# Altium schematic sheet Connectors.SchDoc
size A; SheetNumber: 5; SheetTotal: 8
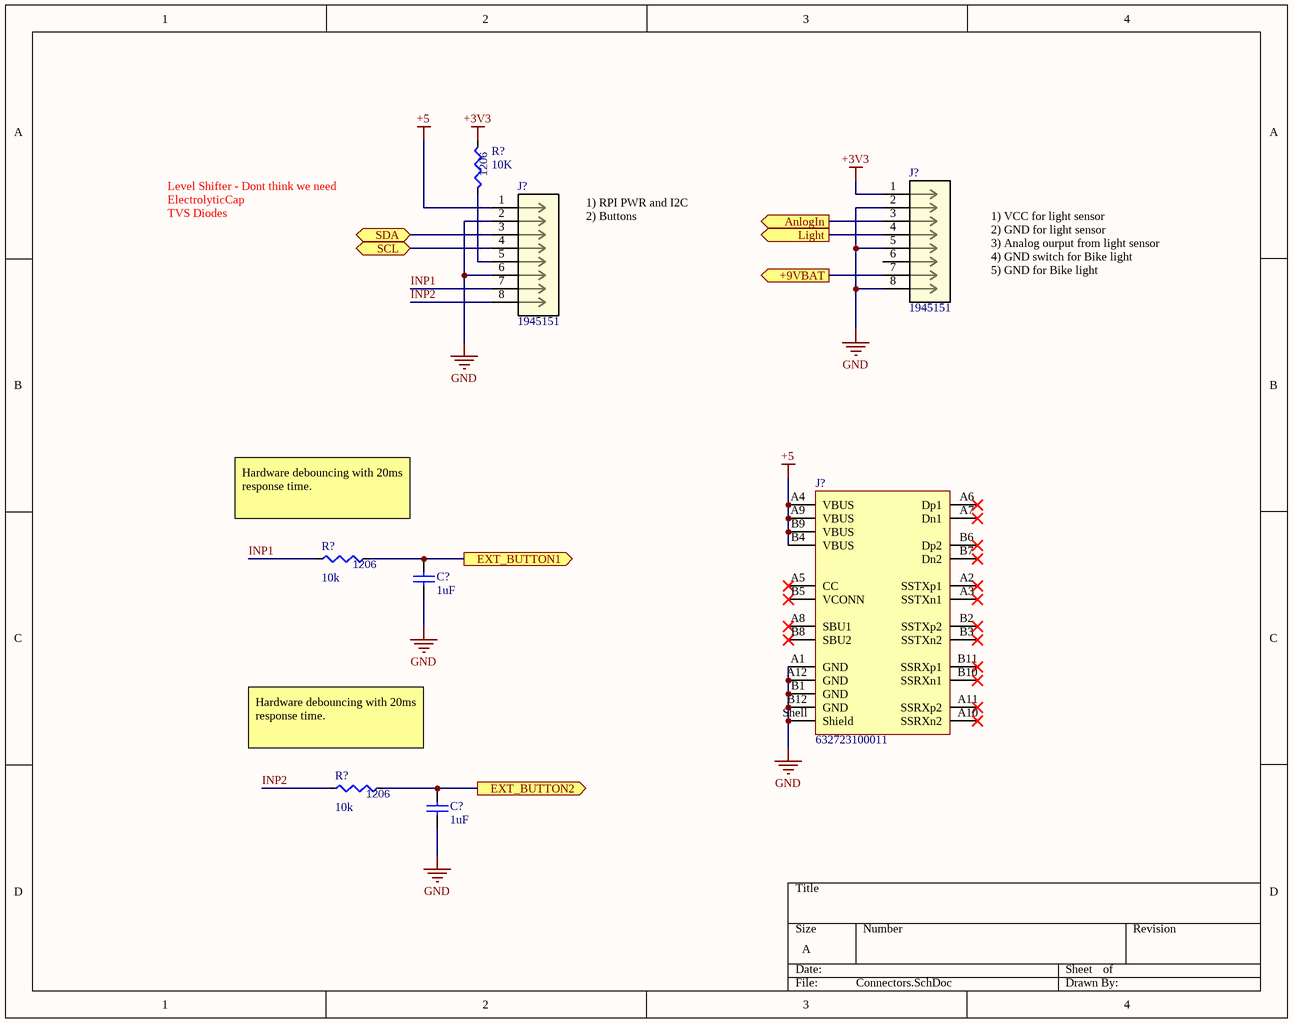
[diagram p0: Connectors.SchDoc]

## Parts
(Parts that share a designator on the sheet are numbered #1, #2 ... from top to bottom, then left to right.)
C?#1  1uF  [C1206]
C?#2  1uF  [C1206]
J?#1  1945151  [1945151-Footprint-1]
J?#2  1945151  [1945151-Footprint-1]
J?#3  632723100011  [632723100011]
R?#1  10K  [R1206]
R?#2  10k  [R1206]
R?#3  10k  [R1206]

## Ports
+9VBAT (out), AnlogIn (out), EXT_BUTTON1 (out), EXT_BUTTON2 (out), Light (out), SCL (bidir), SDA (bidir)

## Nets
+3V3: J?#1.1 R?#1.2
+5: J?#2.1 J?#3.A4(VBUS) J?#3.A9(VBUS) J?#3.B4(VBUS) J?#3.B9(VBUS)
GND: C?#1.1 C?#2.1 J?#1.2 J?#1.5 J?#1.8 J?#2.2 J?#2.6 J?#3.A1(GND) J?#3.A12(GND) J?#3.B1(GND) J?#3.B12(GND) J?#3.Shell(Shield)
+9VBAT: J?#1.7 ; port +9VBAT
AnlogIn: J?#1.3 ; port AnlogIn
EXT_BUTTON1: C?#1.2 R?#2.1 ; port EXT_BUTTON1
EXT_BUTTON2: C?#2.2 R?#3.1 ; port EXT_BUTTON2
INP1: J?#2.7 R?#2.2
INP2: J?#2.8 R?#3.2
Light: J?#1.4 ; port Light
SCL: J?#2.4 ; port SCL
SDA: J?#2.3 ; port SDA
NetJ?#2_5: J?#2.5 R?#1.1

Not connected (* = marked no-connect by the designer): J?#1 6; J?#3 A2(SSTXp1)* A3(SSTXn1)* A5(CC)* A6(Dp1)* A7(Dn1)* A8(SBU1)* A10(SSRXn2)* A11(SSRXp2)* B2(SSTXp2)* B3(SSTXn2)* B5(VCONN)* B6(Dp2)* B7(Dn2)* B8(SBU2)* B10(SSRXn1)* B11(SSRXp1)*

## Notes on the sheet
- Level Shifter - Dont think we need
- ElectrolyticCap
- TVS Diodes
- 1) RPI PWR and I2C
- 2) Buttons
- 1) VCC for light sensor
- 2) GND for light sensor
- 3) Analog ourput from light sensor
- 4) GND switch for Bike light
- 5) GND for Bike light
- Hardware debouncing with 20ms response time.
- (in symbol CMP-024-000007-3) 1206
- (in symbol CMP-024-000034-3) 1206

## Library data of the parts
C?#1 C?#2 = CMP-054-000013-3: CER 1UF 50V X7R 1206; Made by: Brennan Swanton; Reviewed by: Carter Allen; Supplier Part Number 1: 399-C1206C105K5RAC7800CT-ND; Source: Capacitors.SchLib; Design Item ID: CL31B105KBHNNNE; Supplier 1: Digi-Key
J?#1 J?#2 = CMP-00102-1: Strip Terminal Block, 8A, 1 Row(s), 1 Deck(s); Voltage Rating: 160V; Number of Ways: 8; Number of Decks: 1; Fastening Method: SOLDER; Safety Approval: UL; Current Rating: 8A; Reach SVHC Compliant: Yes; Mount: Board; Number of Rows: 1; RoHS Compliant: Yes; Terminal and Terminal Block Type: STRIP TERMINAL BLOCK
J?#3 = CMP-1502-03213-3: NexarPartId: 68112674; Voltage Rating: 20V; Gender: Receptacle; Current Rating: 5A; Pin Length: 1.5mm; Contact Resistance: 30mΩ; Connector Type: USB; USB Standard: USB 3.1; Insulation Resistance: 1GΩ; Number of Contacts: 24; Contact Material: Gold, Nickel; Max Operating Temperature: 105°C; Packaging: Tape and Reel; Height: 3.16mm; RoHS: Compliant; Orientation: Horizontal; Mount: Surface Mount, Through Hole; Number of Pins: 24; Min Operating Temperature: -40°C
R?#1 = CMP-024-000007-3: RES SMD 10K OHM 0.1% 1/4W 1206; Made By: Rita Yang; Source: Resistors.SchLib; Design Item ID: ERA-8AEB103V
R?#2 R?#3 = CMP-024-000034-3: 10K OHM 1% 1/4W 1206; Made By: Brennan Swanton; Reviewed By: Carter Allen; Supplier 1: Digi-Key; Supplier Part Number 1: 541-2247-1-ND; Source: Resistors.SchLib; Design Item ID: ERJ-8ENF1002V